# Altium schematic sheet Sheet1.SchDoc
size 420 x 297 mm; ApprovedBy: Лавлинский; CheckedBy: Енин; CompanyName: АО НПЦ  «ЭЛВИС»; DrawnBy: Грищук; DocumentNumber: РАЯЖ.464512.002Э3; Revision: Лавлинский; SheetNumber: 1; SheetTotal: 4; Title1str: Модуль JC-4-WIFI; ProcessInspection: {Т.контр.}; NormInspection: Былинович; VersionControl_RevNumber: -; IsUserConfigurable: Енин; DocumentType1str: Схема электрическая; DocumentType2str: принципиальная; DocumentType: {Документ}; DocumentName: Лист 1.SCHDOC; ImagePath: РАЯЖ.464512.002
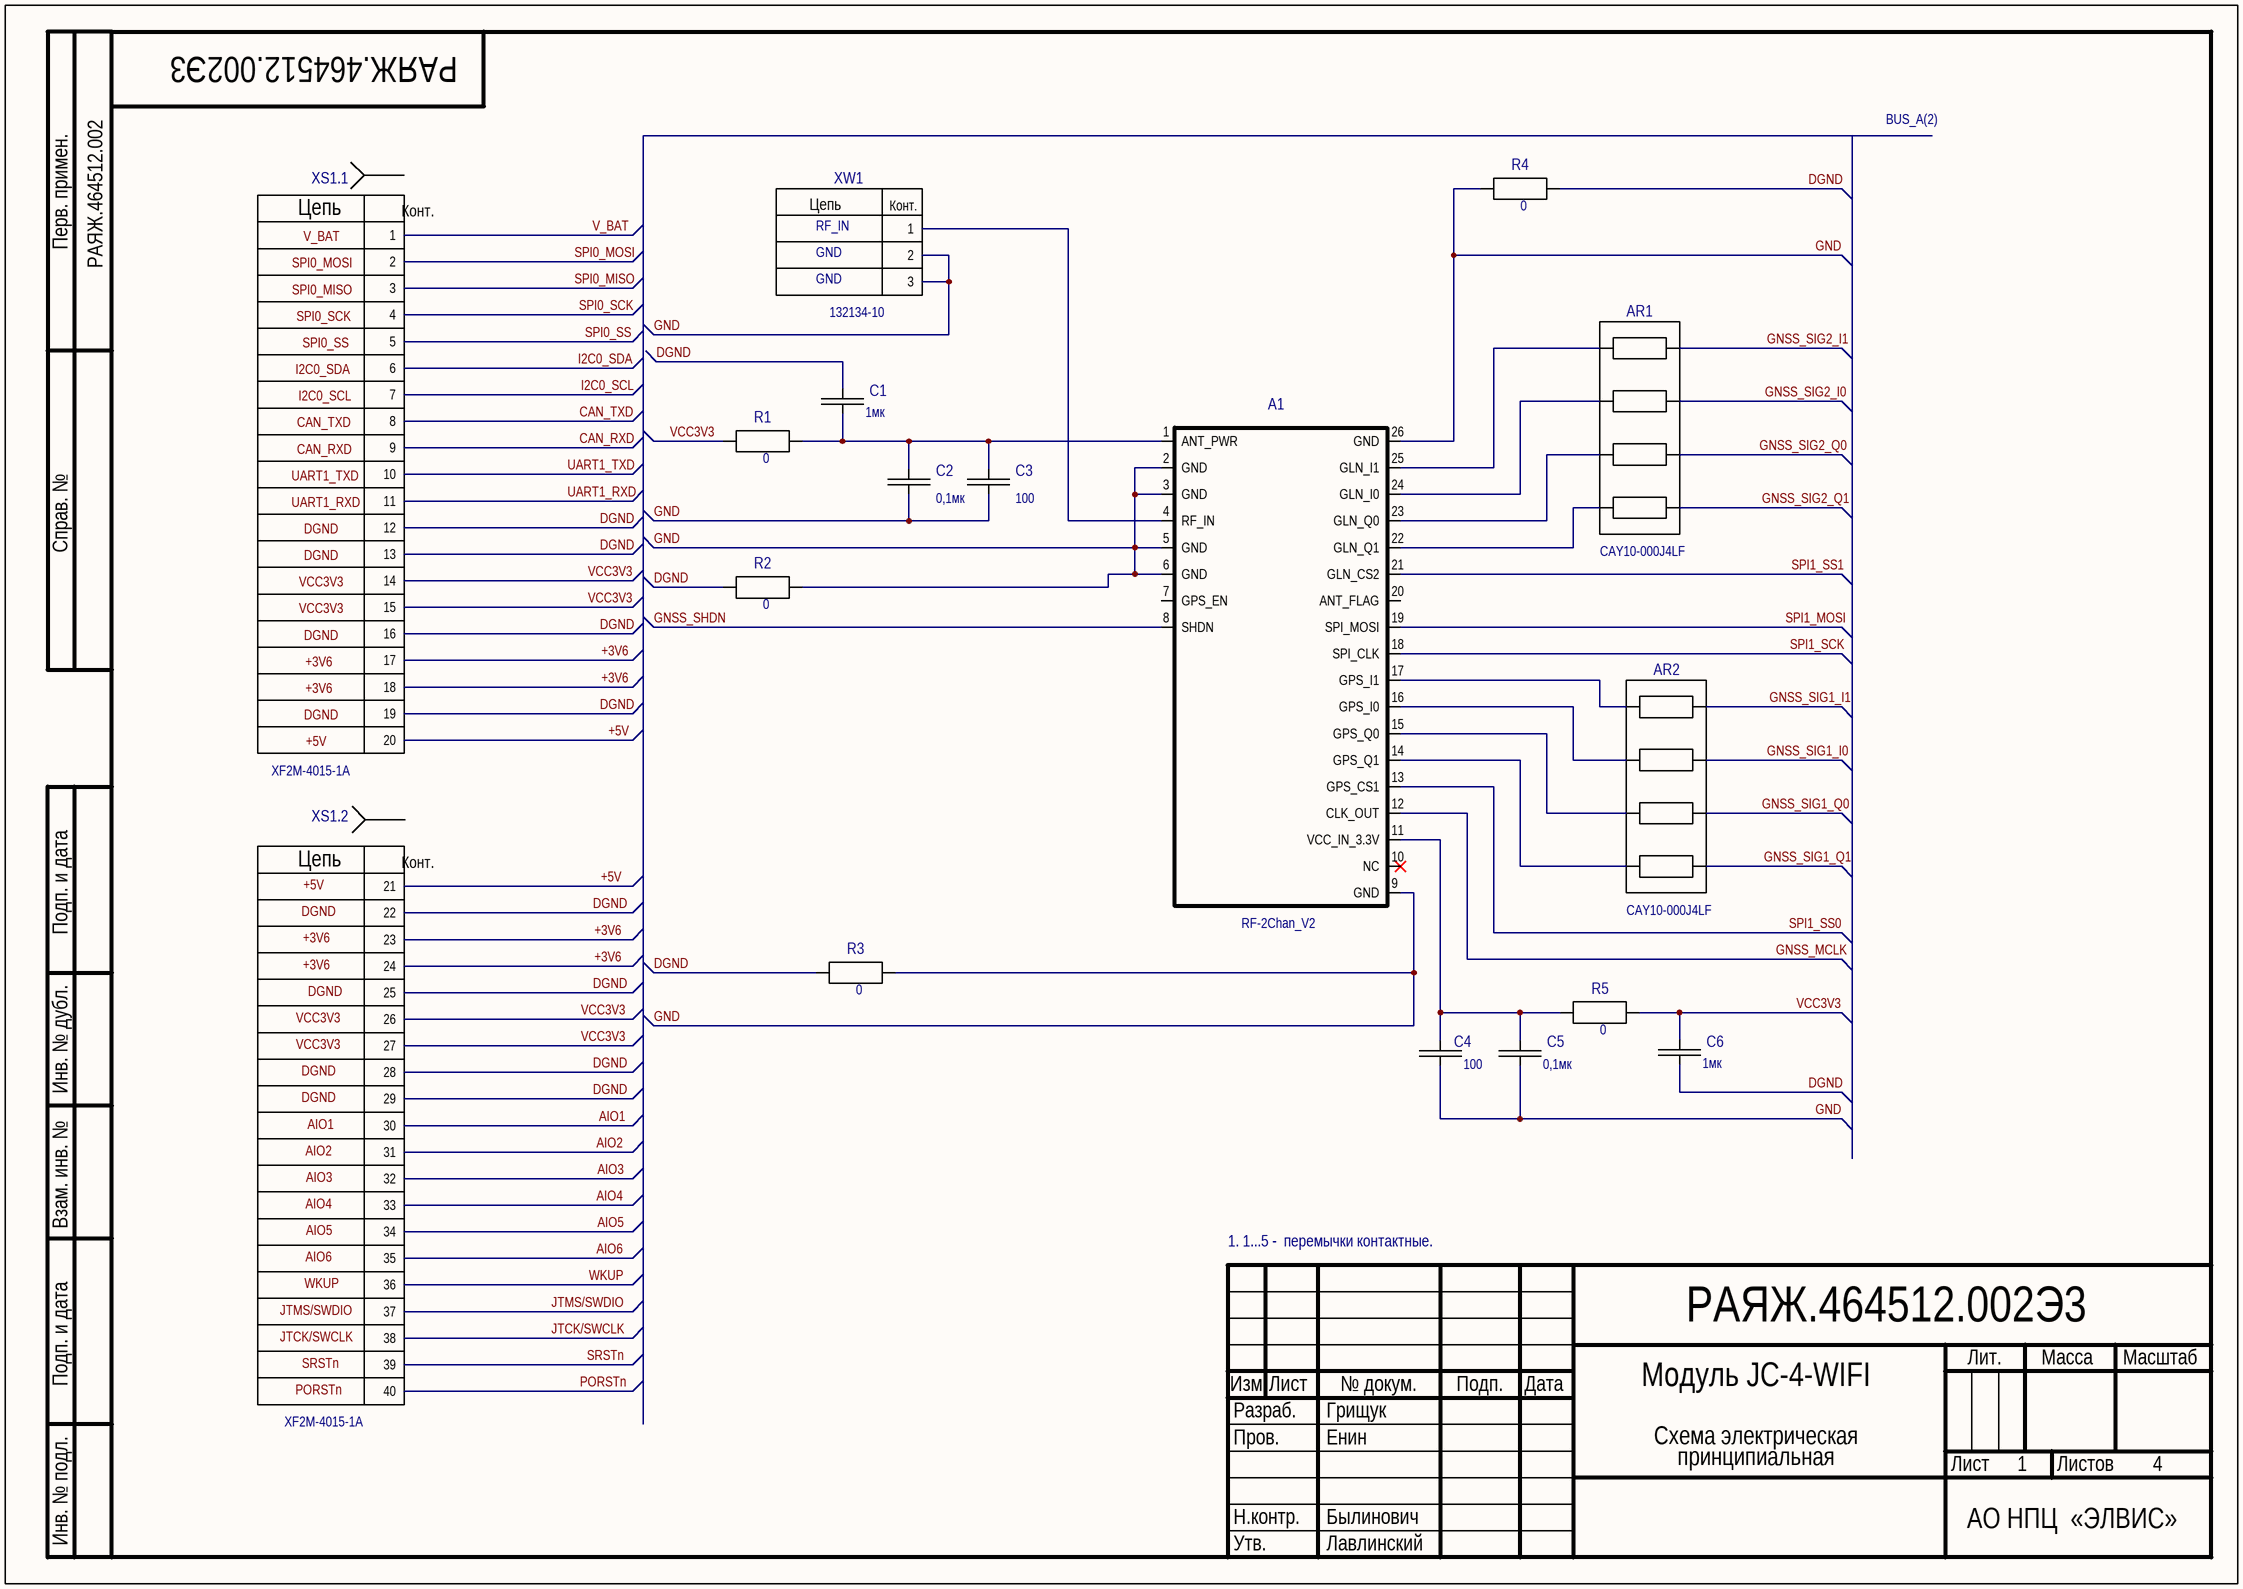
[diagram p0: Sheet1.SchDoc]

## Parts
A1  RF-2Chan_V2  [RF-2Chan_V2]
AR1  CAY10-000J4LF  [CAY10-xxxJ4]
AR2  CAY10-000J4LF  [CAY10-xxxJ4]
C1  1мк  [C0402]
C2  0,1мк  [C0402]
C3  100  [C0402]
C4  100  [C0402]
C5  0,1мк  [C0402]
C6  1мк  [C0402]
R1  0  [R0402]
R2  0  [R0402]
R3  0  [R0402]
R4  0  [R0402]
R5  0  [R0402]
XS1  XF2M-4015-1A  [XF2M-4015-1A]  (parts A,B of 2)
XW1  132134-10  [132134-10]

## Nets
+3V6: XS1.17 XS1.18 XS1.23 XS1.24
+5V: XS1.20 XS1.21
AIO1: XS1.30
AIO2: XS1.31
AIO3: XS1.32
AIO4: XS1.33
AIO5: XS1.34
AIO6: XS1.35
CAN_RXD: XS1.9
CAN_TXD: XS1.8
DGND: C1.1 C6.2 R2.1 R3.1 R4.2 XS1.12 XS1.13 XS1.16 XS1.19 XS1.22 XS1.25 XS1.28 XS1.29
GND: A1.2(GND) A1.3(GND) A1.5(GND) A1.6(GND) A1.9(GND) A1.26(GND) C2.2 C3.2 C4.2 C5.2 R2.2 R3.2 R4.1 XW1.2 XW1.3
GNSS_MCLK: A1.12(CLK_OUT)
GNSS_SHDN: A1.8(SHDN)
GNSS_SIG1_I0: AR2.7
GNSS_SIG1_I1: AR2.8
GNSS_SIG1_Q0: AR2.6
GNSS_SIG1_Q1: AR2.5
GNSS_SIG2_I0: AR1.7
GNSS_SIG2_I1: AR1.8
GNSS_SIG2_Q0: AR1.6
GNSS_SIG2_Q1: AR1.5
I2C0_SCL: XS1.7
I2C0_SDA: XS1.6
JTCK/SWCLK: XS1.38
JTMS/SWDIO: XS1.37
PORSTn: XS1.40
SPI0_MISO: XS1.3
SPI0_MOSI: XS1.2
SPI0_SCK: XS1.4
SPI0_SS: XS1.5
SPI1_MOSI: A1.19(SPI_MOSI)
SPI1_SCK: A1.18(SPI_CLK)
SPI1_SS0: A1.13(GPS_CS1)
SPI1_SS1: A1.21(GLN_CS2)
SRSTn: XS1.39
UART1_RXD: XS1.11
UART1_TXD: XS1.10
V_BAT: XS1.1
VCC3V3: C6.1 R1.1 R5.2 XS1.14 XS1.15 XS1.26 XS1.27
WKUP: XS1.36
NetA1_1: A1.1(ANT_PWR) C1.2 C2.1 C3.1 R1.2
NetA1_4: A1.4(RF_IN) XW1.1
NetA1_11: A1.11(VCC_IN_3.3V) C4.1 C5.1 R5.1
NetA1_14: A1.14(GPS_Q1) AR2.4
NetA1_15: A1.15(GPS_Q0) AR2.3
NetA1_16: A1.16(GPS_I0) AR2.2
NetA1_17: A1.17(GPS_I1) AR2.1
NetA1_22: A1.22(GLN_Q1) AR1.4
NetA1_23: A1.23(GLN_Q0) AR1.3
NetA1_24: A1.24(GLN_I0) AR1.2
NetA1_25: A1.25(GLN_I1) AR1.1

Not connected (* = marked no-connect by the designer): A1 7(GPS_EN) 10(NC)* 20(ANT_FLAG)

## Notes on the sheet
- BUS_A(2)
- XS1.1
- RF_IN
- GND
- XS1.2
- 1. 1...5 -  перемычки контактные.
- Labels drawn without touching a wire or pin: +3V6, +5V, AIO1, AIO2, AIO3, AIO4, AIO5, AIO6, CAN_RXD, CAN_TXD, DGND, I2C0_SCL, I2C0_SDA, JTCK/SWCLK, JTMS/SWDIO, PORSTn, SPI0_MISO, SPI0_MOSI, SPI0_SCK, SPI0_SS, SRSTn, UART1_RXD, UART1_TXD, V_BAT, VCC3V3, WKUP
- Перв. примен.
- Справ. №
- Подп. и дата
- Инв. № дубл.
- Взам. инв. №
- Изм.
- Лист
- № докум.
- Подп.
- Дата
- Лит.
- Масса
- Масштаб
- Пров.
- Разраб.
- Листов
- Инв. № подл.
- Н.контр.
- Утв.
- (in symbol 132134-10) Цепь; Конт.
- (in symbol XF2M-4015-1A, part A) Цепь; Конт.
- (in symbol XF2M-4015-1A, part B) Цепь; Конт.

## Library data of the parts
AR1 AR2 = CAY10-000J4LF: Manufacturer: ф. Bourns; Part Number: CAY10-000J4LF; ManufacturerPartNumber: CAY10-000J4LF; Value: CAY10-000J4LF; ValueBOM: CAY10-000J4LF
C1 C6 = C0402 1uF 10V: Ceramic Capacitors; ManufacturerPartNumber: GRM153R61A105ME95D; Manufacturer: Murata; ValueBOM: C0402-10В-X5R-1 мкФ ± 20%; Part Number: C0402 1uF 10V; Value: 1мк
C2 C5 = C0402 0.1uF 16V: Ceramic Capacitors; ManufacturerPartNumber: GRM188R61E105KA12D; Manufacturer: Murata; ValueBOM: C0402-16В-X7R-0,1 мкФ ± 10%; Part Number: C0402 0.1uF 16V; Value: 0,1мк
C3 C4 = C0402 100pF: Ceramic Capacitors; ManufacturerPartNumber: GRM1555C1H101JA01D; Manufacturer: Murata; ValueBOM: C0402-50В-NPO-100 пФ ± 5%; Part Number: C0402 100pF; Value: 100
R1-R5 = R0402-0: Резистор; ManufacturerPartNumber: RC0402JR-070RL; Manufacturer: Yageo; ValueBOM: RC0402-0,063Вт-0 Ом JUMPER; Part Number: R0402-0; Value: 0
XS1 = XF2M-4015-1A: Rotary Backlock Connector (0.5-mm pitch, Dual Contact); Manufacturer: OMRON; Part Number: XF2M-4015-1A; ManufacturerPartNumber: XF2M-4015-1A; Value: XF2M-4015-1A; ValueBOM: XF2M-4015-1A; Package: XF2M-4015-1A
XW1 = 132134-10: Receplacle, SMD; Part Number: 132134-10; ManufacturerPartNumber: 132134-10; Manufacturer: -; Value: 132134-10; ValueBOM: 132134-10; Package: 132134-10
A1 = RF-2Chan_V2: Part Number: RF-2Chan_V2; ManufacturerPartNumber: RF-2Chan_V2; Manufacturer: -; Value: RF-2Chan_V2; ValueBOM: -; Package: -